# EAGLE schematic t1 (EAGLE 7.5.0)
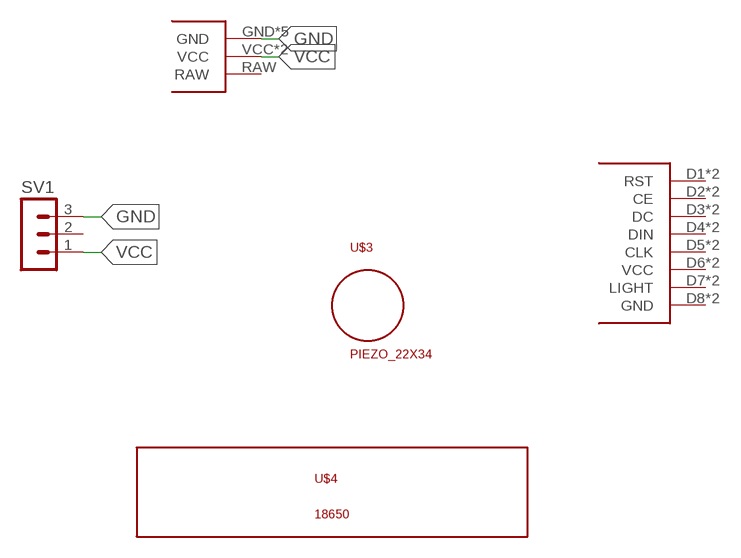
[diagram p0: schematic, sheet 1]

## Parts
SV1  MA03-1  [MA03-1]
U$1  PROMINI_V1  [PROMINI_V1]
U$2  NOKIA_5110  [NOKIA_5110]
U$3  PIEZO_22X34  [PIEZO_22X34]
U$4  18650  [18650]

## Nets
GND: SV1.3 U$1.GND U$1.GND2(GND) U$1.GND3(GND) U$1.GND4(GND) U$1.GND5(GND)
VCC: SV1.1 U$1.VCC U$1.VCC2(VCC)
Unconnected: SV1.2 U$1.2 U$1.3 U$1.4 U$1.5 U$1.6 U$1.7 U$1.8 U$1.9 U$1.10 U$1.11 U$1.12 U$1.13 U$1.A0 U$1.A1 U$1.A2 U$1.A3 U$1.A4 U$1.A5 U$1.A6 U$1.A7 U$1.DTR U$1.RAW U$1.RST U$1.RST2(RST) U$1.RX U$1.RX2(RX) U$1.TX U$1.TX2(TX) U$2.D1(RST) U$2.D2(CE) U$2.D3(DC) U$2.D4(DIN) U$2.D5(CLK) U$2.D6(VCC) U$2.D7(LIGHT) U$2.D8(GND) U$2.U1(RST) U$2.U2(CE) U$2.U3(DC) U$2.U4(DIN) U$2.U5(CLK) U$2.U6(VCC) U$2.U7(LIGHT) U$2.U8(GND)

## Library data of the parts
SV1 = con-lstb:MA03-1: PIN HEADER; OC_FARNELL: unknown; OC_NEWARK: unknown
U$1 = sh4dov lib:PROMINI_V1
U$2 = sh4dov lib:NOKIA_5110
U$3 = sh4dov lib:PIEZO_22X34
U$4 = sh4dov lib:18650